# Altium project pioneer_2-bluepill_eletronic_wrapper.PrjPcb
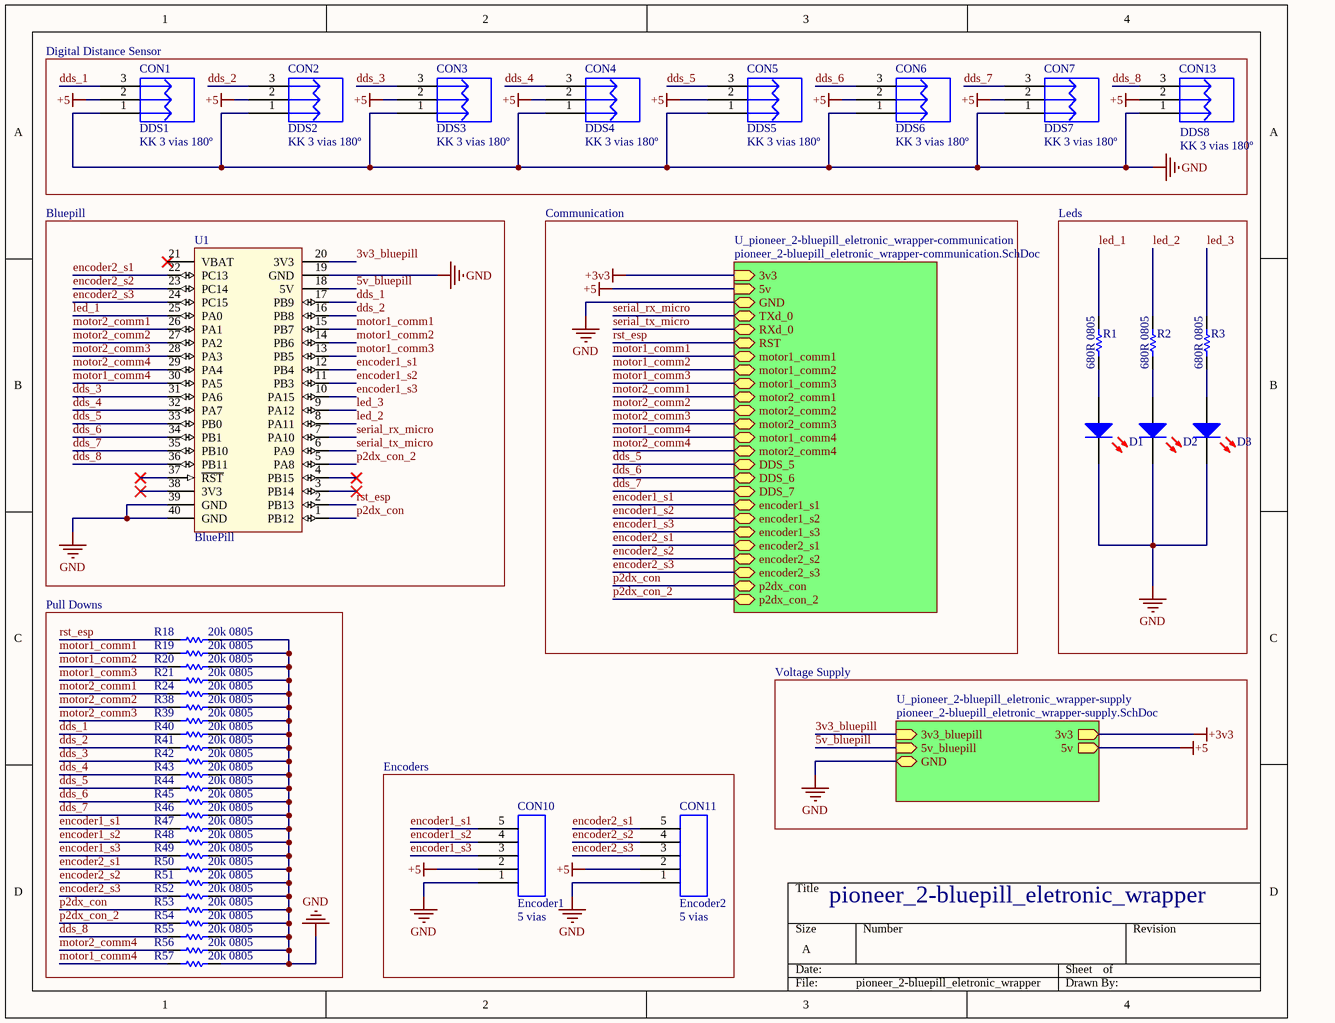
[diagram p0: pioneer_2-bluepill_eletronic_wrapper.SchDoc]
3 sheets, 99 parts. Net scope: hierarchical (ports join the sheet entries above them; power ports are global).
Board file: pioneer_2-bluepill_eletronic_wrapper.PcbDoc
Sheets:
  pioneer_2-bluepill_eletronic_wrapper.SchDoc
    U_pioneer_2-bluepill_eletronic_wrapper-supply = pioneer_2-bluepill_eletronic_wrapper-supply.SchDoc
    U_pioneer_2-bluepill_eletronic_wrapper-communication = pioneer_2-bluepill_eletronic_wrapper-communication.SchDoc

## Sheet pioneer_2-bluepill_eletronic_wrapper.SchDoc
size A; SheetNumber: 1; SheetTotal: 3

### Parts
CON1  DDS1  Valor: KK 3 vias 180º  [KK_3vias_180º]
CON2  DDS2  Valor: KK 3 vias 180º  [KK_3vias_180º]
CON3  DDS3  Valor: KK 3 vias 180º  [KK_3vias_180º]
CON4  DDS4  Valor: KK 3 vias 180º  [KK_3vias_180º]
CON5  DDS5  Valor: KK 3 vias 180º  [KK_3vias_180º]
CON6  DDS6  Valor: KK 3 vias 180º  [KK_3vias_180º]
CON7  DDS7  Valor: KK 3 vias 180º  [KK_3vias_180º]
CON10  Encoder1  Valor: 5 vias  [5vias]
CON11  Encoder2  Valor: 5 vias  [5vias]
CON13  DDS8  Valor: KK 3 vias 180º  [KK_3vias_180º]
D1  LED 3MM RED  [LED RED]  (value not drawn)
D2  LED 3MM RED  [LED RED]  (value not drawn)
D3  LED 3MM RED  [LED RED]  (value not drawn)
R1  680R 0805  [RESISTOR 0805]
R2  680R 0805  [RESISTOR 0805]
R3  680R 0805  [RESISTOR 0805]
R18  20k 0805  [RESISTOR 0805]
R19  20k 0805  [RESISTOR 0805]
R20  20k 0805  [RESISTOR 0805]
R21  20k 0805  [RESISTOR 0805]
R24  20k 0805  [RESISTOR 0805]
R38  20k 0805  [RESISTOR 0805]
R39  20k 0805  [RESISTOR 0805]
R40  20k 0805  [RESISTOR 0805]
R41  20k 0805  [RESISTOR 0805]
R42  20k 0805  [RESISTOR 0805]
R43  20k 0805  [RESISTOR 0805]
R44  20k 0805  [RESISTOR 0805]
R45  20k 0805  [RESISTOR 0805]
R46  20k 0805  [RESISTOR 0805]
R47  20k 0805  [RESISTOR 0805]
R48  20k 0805  [RESISTOR 0805]
R49  20k 0805  [RESISTOR 0805]
R50  20k 0805  [RESISTOR 0805]
R51  20k 0805  [RESISTOR 0805]
R52  20k 0805  [RESISTOR 0805]
R53  20k 0805  [RESISTOR 0805]
R54  20k 0805  [RESISTOR 0805]
R55  20k 0805  [RESISTOR 0805]
R56  20k 0805  [RESISTOR 0805]
R57  20k 0805  [RESISTOR 0805]
U1  BluePill  [BluePill]

### Blocks framed on the sheet
Digital Distance Sensor: CON1-CON7 CON13
Bluepill: U1
Leds: D1-D3 R1-R3
Pull Downs: R18-R21 R24 R38-R57
Encoders: CON10 CON11

### Sub-sheets
U_pioneer_2-bluepill_eletronic_wrapper-communication = pioneer_2-bluepill_eletronic_wrapper-communication.SchDoc: 3v3 (in), 5v (in), GND (bidir), TXd_0 (bidir), RXd_0 (bidir), RST (bidir), motor1_comm1 (bidir), motor1_comm2 (bidir), motor1_comm3 (bidir), motor2_comm1 (bidir), motor2_comm2 (bidir), motor2_comm3 (bidir), motor1_comm4 (bidir), motor2_comm4 (bidir), DDS_5 (bidir), DDS_6 (bidir), DDS_7 (bidir), encoder1_s1 (bidir), encoder1_s2 (bidir), encoder1_s3 (bidir), encoder2_s1 (bidir), encoder2_s2 (bidir), encoder2_s3 (bidir), p2dx_con (bidir), p2dx_con_2 (bidir)
U_pioneer_2-bluepill_eletronic_wrapper-supply = pioneer_2-bluepill_eletronic_wrapper-supply.SchDoc: 3v3_bluepill (in), 5v_bluepill (in), 3v3 (out), 5v (out), GND (bidir)

### Nets
+3v3: sheet U_pioneer_2-bluepill_eletronic_wrapper-supply/3v3, sheet U_pioneer_2-bluepill_eletronic_wrapper-communication/3v3  [project net 3v3]
+5: CON1.2 CON2.2 CON3.2 CON4.2 CON5.2 CON6.2 CON7.2 CON10.2 CON11.2 CON13.2 ; sheet U_pioneer_2-bluepill_eletronic_wrapper-supply/5v, sheet U_pioneer_2-bluepill_eletronic_wrapper-communication/5v  [project net 5v]
GND: CON1.1 CON2.1 CON3.1 CON4.1 CON5.1 CON6.1 CON7.1 CON10.1 CON11.1 CON13.1 D1.2(K) D2.2(K) D3.2(K) R18.2 R19.2 R20.2 R21.2 R24.2 R38.2 R39.2 R40.2 R41.2 R42.2 R43.2 R44.2 R45.2 R46.2 R47.2 R48.2 R49.2 R50.2 R51.2 R52.2 R53.2 R54.2 R55.2 R56.2 R57.2 U1.19(GND) U1.39(GND) U1.40(GND) ; sheet U_pioneer_2-bluepill_eletronic_wrapper-supply/GND, sheet U_pioneer_2-bluepill_eletronic_wrapper-communication/GND
3v3_bluepill: U1.20(3V3) ; sheet U_pioneer_2-bluepill_eletronic_wrapper-supply/3v3_bluepill
5v_bluepill: U1.18(5V) ; sheet U_pioneer_2-bluepill_eletronic_wrapper-supply/5v_bluepill
dds_1: CON1.3 R40.1 U1.17(PB9)
dds_2: CON2.3 R41.1 U1.16(PB8)
dds_3: CON3.3 R42.1 U1.31(PA6)
dds_4: CON4.3 R43.1 U1.32(PA7)
dds_5: CON5.3 R44.1 U1.33(PB0) ; sheet U_pioneer_2-bluepill_eletronic_wrapper-communication/DDS_5
dds_6: CON6.3 R45.1 U1.34(PB1) ; sheet U_pioneer_2-bluepill_eletronic_wrapper-communication/DDS_6
dds_7: CON7.3 R46.1 U1.35(PB10) ; sheet U_pioneer_2-bluepill_eletronic_wrapper-communication/DDS_7
dds_8: CON13.3 R55.1 U1.36(PB11)
encoder1_s1: CON10.5 R47.1 U1.12(PB4) ; sheet U_pioneer_2-bluepill_eletronic_wrapper-communication/encoder1_s1
encoder1_s2: CON10.4 R48.1 U1.11(PB3) ; sheet U_pioneer_2-bluepill_eletronic_wrapper-communication/encoder1_s2
encoder1_s3: CON10.3 R49.1 U1.10(PA15) ; sheet U_pioneer_2-bluepill_eletronic_wrapper-communication/encoder1_s3
encoder2_s1: CON11.5 R50.1 U1.22(PC13) ; sheet U_pioneer_2-bluepill_eletronic_wrapper-communication/encoder2_s1
encoder2_s2: CON11.4 R51.1 U1.23(PC14) ; sheet U_pioneer_2-bluepill_eletronic_wrapper-communication/encoder2_s2
encoder2_s3: CON11.3 R52.1 U1.24(PC15) ; sheet U_pioneer_2-bluepill_eletronic_wrapper-communication/encoder2_s3
led_1: R1.2 U1.25(PA0)
led_2: R2.2 U1.8(PA11)
led_3: R3.2 U1.9(PA12)
motor1_comm1: R19.1 U1.15(PB7) ; sheet U_pioneer_2-bluepill_eletronic_wrapper-communication/motor1_comm1
motor1_comm2: R20.1 U1.14(PB6) ; sheet U_pioneer_2-bluepill_eletronic_wrapper-communication/motor1_comm2
motor1_comm3: R21.1 U1.13(PB5) ; sheet U_pioneer_2-bluepill_eletronic_wrapper-communication/motor1_comm3
motor1_comm4: R57.1 U1.30(PA5) ; sheet U_pioneer_2-bluepill_eletronic_wrapper-communication/motor1_comm4
motor2_comm1: R24.1 U1.26(PA1) ; sheet U_pioneer_2-bluepill_eletronic_wrapper-communication/motor2_comm1
motor2_comm2: R38.1 U1.27(PA2) ; sheet U_pioneer_2-bluepill_eletronic_wrapper-communication/motor2_comm2
motor2_comm3: R39.1 U1.28(PA3) ; sheet U_pioneer_2-bluepill_eletronic_wrapper-communication/motor2_comm3
motor2_comm4: R56.1 U1.29(PA4) ; sheet U_pioneer_2-bluepill_eletronic_wrapper-communication/motor2_comm4
p2dx_con: R53.1 U1.1(PB12) ; sheet U_pioneer_2-bluepill_eletronic_wrapper-communication/p2dx_con
p2dx_con_2: R54.1 U1.5(PA8) ; sheet U_pioneer_2-bluepill_eletronic_wrapper-communication/p2dx_con_2
rst_esp: R18.1 U1.2(PB13) ; sheet U_pioneer_2-bluepill_eletronic_wrapper-communication/RST
serial_rx_micro: U1.7(PA10) ; sheet U_pioneer_2-bluepill_eletronic_wrapper-communication/TXd_0
serial_tx_micro: U1.6(PA9) ; sheet U_pioneer_2-bluepill_eletronic_wrapper-communication/RXd_0  [project net rxd0_bluepill]
NetD1_1: D1.1(A) R1.1
NetD2_1: D2.1(A) R2.1
NetD3_1: D3.1(A) R3.1

Not connected (* = marked no-connect by the designer): U1 3(PB14)* 4(PB15)* 21(VBAT)* 37(~{RST})* 38(3V3)*

### Notes on the sheet
- Communication
- Voltage Supply
- pioneer_2-bluepill_eletronic_wrapper

### Library data of the parts
CON1-CON7 CON13 = KK_2.54_3vias: Conector KK 2.54mm 3 vias; Descrição: Conector KK 3 vias com passo 2.54mm; Encapsulamento: PTH - 180º; Modelo: 3 vias - 180º; Marca: *; Observação: *
CON10 CON11 = 2.54_5vias: holes 2.54mm 5 vias; Descrição: Conector KK 3 vias com passo 2.54mm; Encapsulamento: PTH - 180º; Modelo: 3 vias - 180º; Marca: *; Observação: *
D1-D3 = LED 3MM RED: Manufacturer: Paralight; Manufacturer Part Number: IMP585; Wavelength Typ: 625; Forward Voltage: 2; Forward Current If: 20; Luminous Intensity: 3; LED Mounting: Through Hole; Lens Shape: Round; Viewing Angle: 60°; SVHC: No SVHC (15-Jun-2015); External Diameter: 2.9; External Length / Height: 4.6; Forward Voltage VF Max: 2.5; LED / Lamp Size: 3mm / T-1; LED Type: Standard; Lead Cross-section Depth: 0.5; Luminous Intensity @ If Min: 0.7; PIV Max: 5; Peak Forward Current: 7; Voltage Vf Typ: 2.2V<!--FANDB--><div class="features-and-benefits-container"><div class="features-and-benefits-description"><span class="features-benefits-value">The L-934LID from Kingbright is a through hole round shape high efficiency red colour LED. The device is made of gallium arsenide phosphide on gallium phosphide orange light emitting diode. This LED is widely used because of low power consumption, long life and solid state reliability.</span></div><div class="features-and-benefits-list"><ul class="features-and-benefits-list-list"><li class="features-and-benefits-list-item">Standard bulb size of T-1 (3mm)</li><li class="features-and-benefits-list-item">Reliable and rugged</li><li class="features-and-benefits-list-item">Viewing angle is 60°</li><li class="features-and-benefits-list-item">Luminous intensity of 3mcd at 2mA</li><li class="features-and-benefits-list-item">Forward voltage is 2.0V</li><li class="features-and-benefits-list-item">Forward current (If) is 20mA</li><li class="features-and-benefits-list-item">Dominant wavelength is 625nm at IF=20mA</li><li class="features-and-benefits-list-item">Peak wavelength is 627nm at IF=20; Supplier 1: Mult Comercial; RoHS: YES; Stock 1: 35260; Pricing 1: 1=0.15 (BRL); LED Colour: Red; Bulb Size: 3mm; Packaging: Each; MSL: -; Current If Luminous Intensity: 2; Dominant Wavelength: 625; Forward Current If Max: 20; Lead Cross-section Width: 0.5; Lead Spacing: 2.54; Luminous Intensity Typ: 3; Mounting Type: PCB Through Hole; No. of Pins: 2; Operating Temperature Max: 85; Operating Temperature Min: -40; Operating Temperature Range: -40°C to +85; Peak Wavelength: 625; ComponentLink1URL: http://loja.multcomercial.com.br/led-3mm-vermelho-difuso-l-314hd-paralight.html; ComponentLink1Description: http://loja.multcomercial.com.br/led-3mm-vermelho-difuso-l-314hd-paralight.html; Supplier Part Number 1: Led 3mm Vermelho Difuso L-314HD - Paralight
R1-R3 R18-R21 R24 R38-R57 = RES 0805 5%: 0805; Manufacturer: PANASONIC ELECTRONIC COMPONENTS; Manufacturer Part Number: ERJ-3GEY0R00V; Product Range: AEC-Q200 ERJ3; Resistance: 0; Power Rating: 100; Voltage Rating: 75; Resistor Case Style: 0603 [1608 Metric]; Resistance (Ohms): 0.0; Tolerance: Jumper; Power (Watts): 0.1W, 1/10W; Brand: Panasonic; Qualification: AEC-Q200; RoHS: YES; Resistance Tolerance: -; Packaging: Cut Tape; MSL: -; ComponentLink1URL: http://www.farnell.com/cad/1697908.zip; ComponentLink1Description: http://www.farnell.com/cad/1697908.zip; ComponentLink2URL: http://www.farnell.com/datasheets/1678796.pdf; ComponentLink2Description: http://www.farnell.com/datasheets/1678796.pdf; Category: Resistors; Composition: Thick Film; Features: Automotive AEC-Q200; Temperature Coefficient: -; Operating Temperature: -55°C ~ 155°C; Package / Case: 0603 (1608 Metric); Supplier Device Package: 0603; Size / Dimension: 0.063" L x 0.031" W (1.60mm x 0.80mm); Height: 0.022" (0.55mm); Number of Terminations: 2; ComponentLink3URL: http://industrial.panasonic.com/www-cgi/jvcr13pz.cgi?E+PZ+3+AOA0001+ERJ3GEY0R00V+7+WW; ComponentLink3Description: http://industrial.panasonic.com/www-cgi/jvcr13pz.cgi?E+PZ+3+AOA0001+ERJ3GEY0R00V+7+WW; Supplier 1: Mouser; Stock 1: 1987085; Pricing 1: 1=0.160, 10=0.019, 100=0.013, 500=0.010, 1000=0.005, 5000=0.003 (AUD); Length: 1.6 mm; Operating Temperature Range: - 55 C to + 155 C; Product: Thick Film Resistors Zero-Ohm; Series: ERJ; Termination Style: SMD/SMT; Type: Thick Film Resistors SMD; Width: 0.8 mm; Case Code - in: 0603; Case Code - mm: 1608; RoHS - Mouser: E; Minimum Order Quantity: 1; Reeling: True; ComponentLink4URL: http://www.mouser.com/ds/2/315/AOA0000C84-947596.pdf; ComponentLink4Description: http://www.mouser.com/ds/2/315/AOA0000C84-947596.pdf; Supplier Part Number 1: 667-ERJ-3GEY0R00V
U1 = CMP-010-000000-1: BluePill - STMDuino (STM32F103); Source: uControlador.SchLib; Design Item ID: BluePill; Component Type: Interface

## Sheet pioneer_2-bluepill_eletronic_wrapper-supply.SchDoc
size A; SheetNumber: 2; SheetTotal: 3
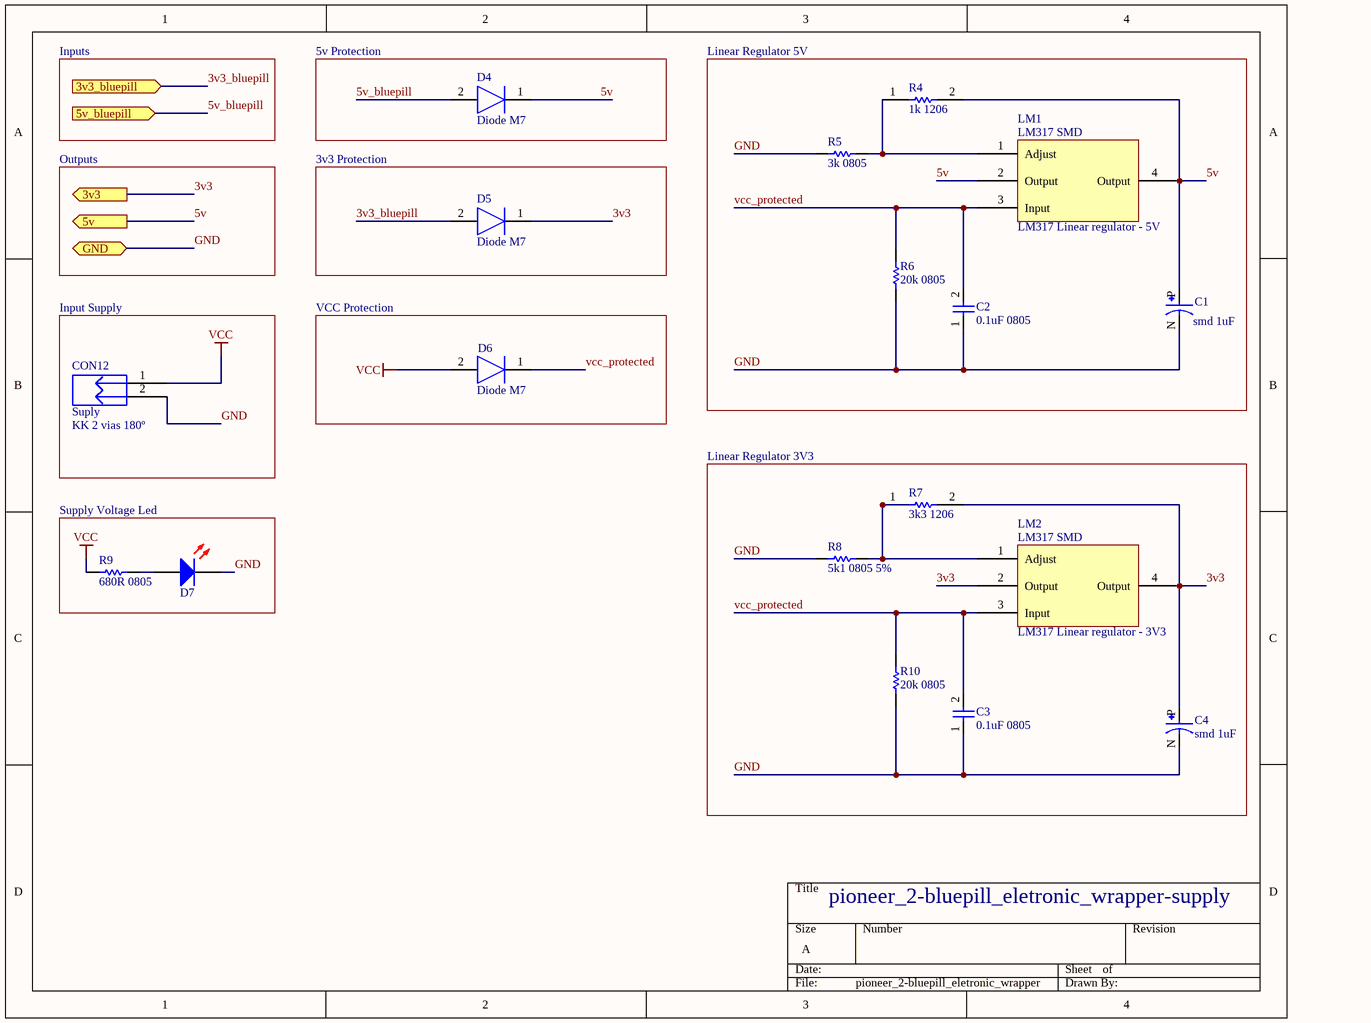
[diagram p1: pioneer_2-bluepill_eletronic_wrapper-supply.SchDoc]

### Parts
C1  smd 1uF  [CAP_EEE1HA2R2SR]
C2  0.1uF 0805  [CAPACITOR 0805]
C3  0.1uF 0805  [CAPACITOR 0805]
C4  smd 1uF  [CAP_EEE1HA2R2SR]
CON12  Suply  Valor: KK 2 vias 180º  [KK_2VIAS_180º]
D4  Diode M7  [DIOM505270X240]
D5  Diode M7  [DIOM505270X240]
D6  Diode M7  [DIOM505270X240]
D7  LED 3MM RED  [LED RED]  (value not drawn)
LM1  LM317 Linear regulator - 5V  [SOT-223-2]
LM2  LM317 Linear regulator - 3V3  [SOT-223-2]
R4  1k 1206  [RESC3216X60N]
R5  3k 0805  [RESISTOR 0805]
R6  20k 0805  [RESISTOR 0805]
R7  3k3 1206  [RESC3216X60N]
R8  5k1 0805 5%  [RESISTOR 0805]
R9  680R 0805  [RESISTOR 0805]
R10  20k 0805  [RESISTOR 0805]

### Blocks framed on the sheet
5v Protection: D4
Linear Regulator 5V: C1 C2 LM1 R4-R6
3v3 Protection: D5
Input Supply: CON12
VCC Protection: D6
Linear Regulator 3V3: C3 C4 LM2 R7 R8 R10
Supply Voltage Led: D7 R9

### Ports
3v3 (out, see pioneer_2-bluepill_eletronic_wrapper[4C], pioneer_2-bluepill_eletronic_wrapper-communication[1A]), 3v3_bluepill (in, see pioneer_2-bluepill_eletronic_wrapper[3C]), 5v (out, see pioneer_2-bluepill_eletronic_wrapper[4C], pioneer_2-bluepill_eletronic_wrapper-communication[1A]), 5v_bluepill (in, see pioneer_2-bluepill_eletronic_wrapper[3C]), GND (bidir, see pioneer_2-bluepill_eletronic_wrapper[3C], pioneer_2-bluepill_eletronic_wrapper-communication[1A])

### Nets
3v3: C4.P D5.1(K) LM2.2(Output) LM2.4(Output) R7.2 ; port 3v3
5v: C1.P D4.1(K) LM1.2(Output) LM1.4(Output) R4.2 ; port 5v
GND: C1.N C2.1 C3.1 C4.N CON12.2 D7.2(K) R5.2 R6.2 R8.1 R10.2 ; port GND
VCC: CON12.1 D6.2(A) R9.2
3v3_bluepill: D5.2(A) ; port 3v3_bluepill
5v_bluepill: D4.2(A) ; port 5v_bluepill
vcc_protected: C2.2 C3.2 D6.1(K) LM1.3(Input) LM2.3(Input) R6.1 R10.1
NetD7_1: D7.1(A) R9.1
NetLM1_1: LM1.1(Adjust) R4.1 R5.1
NetLM2_1: LM2.1(Adjust) R7.1 R8.2

### Notes on the sheet
- Inputs
- Outputs
- pioneer_2-bluepill_eletronic_wrapper-supply
- (in symbol lm317 smd) LM317 SMD

### Library data of the parts
C1 C4 = Cap. Elet. smd 1uF 50V: Aluminum Organic Polymer Capacitors smd 50volts 1uF; Manufacturer_Name: Panasonic; Manufacturer_Part_Number: 16SEPC470M; Datasheet Link: http://industrial.panasonic.com/www-cgi/jvcr13pz.cgi?E+CI+4+AAB8010+16SEPC470M+8+WW; Height: 13mm; Mouser Part Number: 667-16SEPC470M; Mouser Price/Stock: https://www.mouser.co.uk/ProductDetail/Panasonic/16SEPC470M?qs=OE1iw1LrrPEdZuWyF2l%252B5w%3D%3D; Arrow Part Number: 16SEPC470M; Arrow Price/Stock: https://www.arrow.com/en/products/16sepc470m/panasonic
C2 C3 = CAP 0805: capacitor 0805; Manufacturer: PANASONIC ELECTRONIC COMPONENTS; Manufacturer Part Number: ERJ-3GEY0R00V; Product Range: AEC-Q200 ERJ3; Resistance: 0; Power Rating: 100; Voltage Rating: 75; Resistor Case Style: 0603 [1608 Metric]; Resistance (Ohms): 0.0; Tolerance: Jumper; Power (Watts): 0.1W, 1/10W; Type: Thick Film Resistors SMD; Brand: Panasonic; Qualification: AEC-Q200; RoHS: YES; Resistance Tolerance: -; Packaging: Cut Tape; MSL: -; ComponentLink1URL: http://www.farnell.com/cad/1697908.zip; ComponentLink1Description: http://www.farnell.com/cad/1697908.zip; ComponentLink2URL: http://www.farnell.com/datasheets/1678796.pdf; ComponentLink2Description: http://www.farnell.com/datasheets/1678796.pdf; Category: Resistors; Composition: Thick Film; Features: Automotive AEC-Q200; Temperature Coefficient: -; Operating Temperature: -55°C ~ 155°C; Package / Case: 0603 (1608 Metric); Supplier Device Package: 0603; Size / Dimension: 0.063" L x 0.031" W (1.60mm x 0.80mm); Height: 0.022" (0.55mm); Number of Terminations: 2; ComponentLink3URL: http://industrial.panasonic.com/www-cgi/jvcr13pz.cgi?E+PZ+3+AOA0001+ERJ3GEY0R00V+7+WW; ComponentLink3Description: http://industrial.panasonic.com/www-cgi/jvcr13pz.cgi?E+PZ+3+AOA0001+ERJ3GEY0R00V+7+WW; Supplier 1: Mouser; Stock 1: 1987085; Pricing 1: 1=0.160, 10=0.019, 100=0.013, 500=0.010, 1000=0.005, 5000=0.003 (AUD); Length: 1.6 mm; Operating Temperature Range: - 55 C to + 155 C; Product: Thick Film Resistors Zero-Ohm; Series: ERJ; Termination Style: SMD/SMT; Width: 0.8 mm; Case Code - in: 0603; Case Code - mm: 1608; RoHS - Mouser: E; Minimum Order Quantity: 1; Reeling: True; ComponentLink4URL: http://www.mouser.com/ds/2/315/AOA0000C84-947596.pdf; ComponentLink4Description: http://www.mouser.com/ds/2/315/AOA0000C84-947596.pdf; Supplier Part Number 1: 667-ERJ-3GEY0R00V
CON12 = KK_2.54_2vias: Conector KK 2.54mm 2 vias; Descrição: Conector KK 3 vias com passo 2.54mm; Encapsulamento: PTH - 180º; Modelo: 2 vias - 180º; Marca: *; Observação: *
D4-D6 = Diode M7: Diode, SMA, 1000V, 1A, 150°C; MF: Diotec Semiconductor; SnapEDA_Link: https://www.snapeda.com/parts/M7/Diotec/view-part/?ref=snap; Package: DO-214AC Diotec; Value: *; MP: M7; Check_prices: https://www.snapeda.com/parts/M7/Diotec/view-part/?ref=eda
D7 = LED 3MM RED: as D1 on sheet pioneer_2-bluepill_eletronic_wrapper; Supplier 1: Mult Comercial; RoHS: YES; Stock 1: 35260; Pricing 1: 1=0.15 (BRL); LED Colour: Red; Bulb Size: 3mm; Packaging: Each; MSL: -; Current If Luminous Intensity: 2; Dominant Wavelength: 625; Forward Current If Max: 20; Lead Cross-section Width: 0.5; Lead Spacing: 2.54; Luminous Intensity Typ: 3; Mounting Type: PCB Through Hole; No. of Pins: 2; Operating Temperature Max: 85; Operating Temperature Min: -40; Operating Temperature Range: -40°C to +85; Peak Wavelength: 625; ComponentLink1URL: http://loja.multcomercial.com.br/led-3mm-vermelho-difuso-l-314hd-paralight.html; ComponentLink1Description: http://loja.multcomercial.com.br/led-3mm-vermelho-difuso-l-314hd-paralight.html; Supplier Part Number 1: Led 3mm Vermelho Difuso L-314HD - Paralight
LM1 LM2 = lm317 smd: SOT223
R4 R7 = RES 1206: RES 1206 5%; Manufacturer_Name: Vishay; Manufacturer_Part_Number: CRCW12064K70FKEA; Datasheet Link: http://docs-emea.rs-online.com/webdocs/13ec/0900766b813ecc08.pdf; Height: 0.6mm; Mouser Part Number: 71-CRCW1206-4.7K-E3; Mouser Price/Stock: https://www.mouser.co.uk/ProductDetail/Vishay-Dale/CRCW12064K70FKEA?qs=1vm4qhDHCvlKJmatsKzyFQ%3D%3D; Arrow Part Number: CRCW12064K70FKEA; Arrow Price/Stock: https://www.arrow.com/en/products/crcw12064k70fkea/vishay
R5 R6 R8-R10 = RES 0805 5%: as R1 on sheet pioneer_2-bluepill_eletronic_wrapper; RoHS: YES; Resistance Tolerance: -; Packaging: Cut Tape; MSL: -; ComponentLink1URL: http://www.farnell.com/cad/1697908.zip; ComponentLink1Description: http://www.farnell.com/cad/1697908.zip; ComponentLink2URL: http://www.farnell.com/datasheets/1678796.pdf; ComponentLink2Description: http://www.farnell.com/datasheets/1678796.pdf; Category: Resistors; Composition: Thick Film; Features: Automotive AEC-Q200; Temperature Coefficient: -; Operating Temperature: -55°C ~ 155°C; Package / Case: 0603 (1608 Metric); Supplier Device Package: 0603; Size / Dimension: 0.063" L x 0.031" W (1.60mm x 0.80mm); Height: 0.022" (0.55mm); Number of Terminations: 2; ComponentLink3URL: http://industrial.panasonic.com/www-cgi/jvcr13pz.cgi?E+PZ+3+AOA0001+ERJ3GEY0R00V+7+WW; ComponentLink3Description: http://industrial.panasonic.com/www-cgi/jvcr13pz.cgi?E+PZ+3+AOA0001+ERJ3GEY0R00V+7+WW; Supplier 1: Mouser; Stock 1: 1987085; Pricing 1: 1=0.160, 10=0.019, 100=0.013, 500=0.010, 1000=0.005, 5000=0.003 (AUD); Length: 1.6 mm; Operating Temperature Range: - 55 C to + 155 C; Product: Thick Film Resistors Zero-Ohm; Series: ERJ; Termination Style: SMD/SMT; Type: Thick Film Resistors SMD; Width: 0.8 mm; Case Code - in: 0603; Case Code - mm: 1608; RoHS - Mouser: E; Minimum Order Quantity: 1; Reeling: True; ComponentLink4URL: http://www.mouser.com/ds/2/315/AOA0000C84-947596.pdf; ComponentLink4Description: http://www.mouser.com/ds/2/315/AOA0000C84-947596.pdf; Supplier Part Number 1: 667-ERJ-3GEY0R00V

## Sheet pioneer_2-bluepill_eletronic_wrapper-communication.SchDoc
size A; SheetNumber: 3; SheetTotal: 3
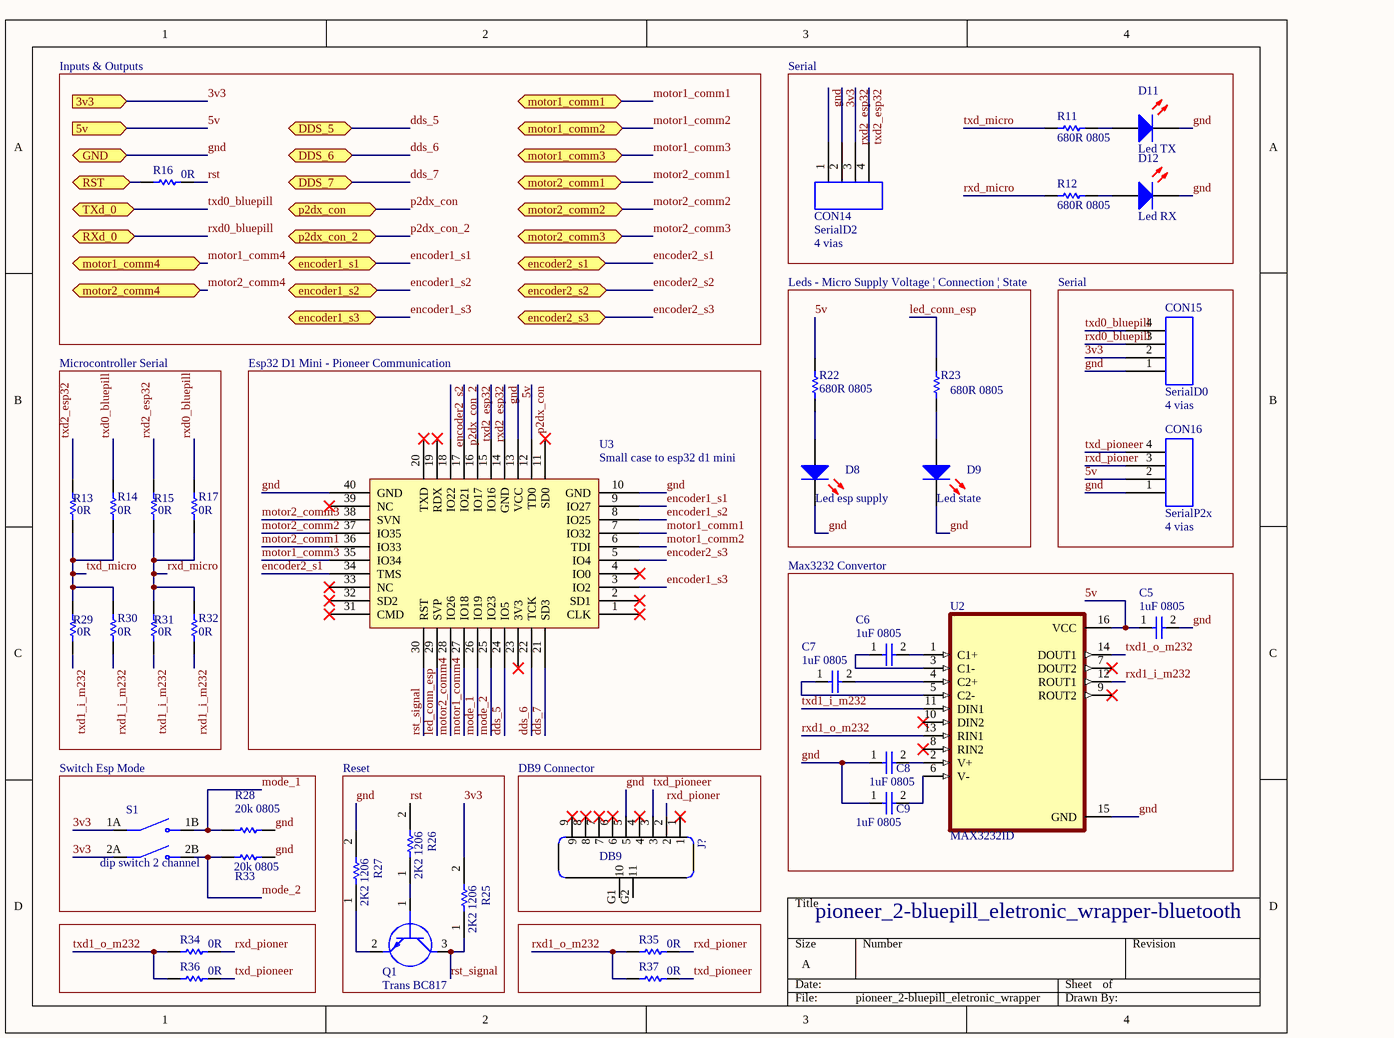
[diagram p2: pioneer_2-bluepill_eletronic_wrapper-communication.SchDoc]

### Parts
C5  1uF 0805  [CAPACITOR 0805]
C6  1uF 0805  [CAPACITOR 0805]
C7  1uF 0805  [CAPACITOR 0805]
C8  1uF 0805  [CAPACITOR 0805]
C9  1uF 0805  [CAPACITOR 0805]
CON14  SerialD2  Valor: 4 vias  [4vias]
CON15  SerialD0  Valor: 4 vias  [4vias]
CON16  SerialP2x  Valor: 4 vias  [4vias]
D8  Led esp supply  [LED RED]
D9  Led state  [LED RED]
D11  Led TX  [LED RED]
D12  Led RX  [LED RED]
J?  DB9  [*DB9_DB9(Primary)]
Q1  Trans BC817  [SOT96P240X110-3N]
R11  680R 0805  [RESISTOR 0805]
R12  680R 0805  [RESISTOR 0805]
R13  0R  [RESISTOR 0603]
R14  0R  [RESISTOR 0603]
R15  0R  [RESISTOR 0603]
R16  0R  [RESISTOR 0603]
R17  0R  [RESISTOR 0603]
R22  680R 0805  [RESISTOR 0805]
R23  680R 0805  [RESISTOR 0805]
R25  2K2 1206  [RESC3216X60N]
R26  2K2 1206  [RESC3216X60N]
R27  2K2 1206  [RESC3216X60N]
R28  20k 0805  [RESISTOR 0805]
R29  0R  [RESISTOR 0603]
R30  0R  [RESISTOR 0603]
R31  0R  [RESISTOR 0603]
R32  0R  [RESISTOR 0603]
R33  20k 0805  [RESISTOR 0805]
R34  0R  [RESISTOR 0603]
R35  0R  [RESISTOR 0603]
R36  0R  [RESISTOR 0603]
R37  0R  [RESISTOR 0603]
S1  dip switch 2 channel  [SW_DS02-254-2L-02BE]
U2  MAX3232ID  [SOIC127P600X175-16N]
U3  Small case to esp32 d1 mini  [ESP32 D1 MINI]

### Blocks framed on the sheet
Inputs & Outputs: R16
Serial: CON14 D11 D12 R11 R12
Leds - Micro Supply Voltage | Connection | State: D8 D9 R22 R23
Serial: CON15 CON16
Microcontroller Serial: R13-R15 R17 R29-R32
Esp32 D1 Mini - Pioneer Communication: U3
Max3232 Convertor: C5-C9 U2
Switch Esp Mode: R28 R33 S1
Reset: Q1 R25-R27
DB9 Connector: J?

### Ports
3v3 (in, see pioneer_2-bluepill_eletronic_wrapper[3B], pioneer_2-bluepill_eletronic_wrapper-supply[1A]), 5v (in, see pioneer_2-bluepill_eletronic_wrapper[3B], pioneer_2-bluepill_eletronic_wrapper-supply[1A]), DDS_5 (bidir, see pioneer_2-bluepill_eletronic_wrapper[3B]), DDS_6 (bidir, see pioneer_2-bluepill_eletronic_wrapper[3B]), DDS_7 (bidir, see pioneer_2-bluepill_eletronic_wrapper[3B]), encoder1_s1 (bidir, see pioneer_2-bluepill_eletronic_wrapper[3B]), encoder1_s2 (bidir, see pioneer_2-bluepill_eletronic_wrapper[3C]), encoder1_s3 (bidir, see pioneer_2-bluepill_eletronic_wrapper[3C]), encoder2_s1 (bidir, see pioneer_2-bluepill_eletronic_wrapper[3C]), encoder2_s2 (bidir, see pioneer_2-bluepill_eletronic_wrapper[3C]), encoder2_s3 (bidir, see pioneer_2-bluepill_eletronic_wrapper[3C]), GND (bidir, see pioneer_2-bluepill_eletronic_wrapper[3B], pioneer_2-bluepill_eletronic_wrapper-supply[1A]), motor1_comm1 (bidir, see pioneer_2-bluepill_eletronic_wrapper[3B]), motor1_comm2 (bidir, see pioneer_2-bluepill_eletronic_wrapper[3B]), motor1_comm3 (bidir, see pioneer_2-bluepill_eletronic_wrapper[3B]), motor1_comm4 (bidir, see pioneer_2-bluepill_eletronic_wrapper[3B]), motor2_comm1 (bidir, see pioneer_2-bluepill_eletronic_wrapper[3B]), motor2_comm2 (bidir, see pioneer_2-bluepill_eletronic_wrapper[3B]), motor2_comm3 (bidir, see pioneer_2-bluepill_eletronic_wrapper[3B]), motor2_comm4 (bidir, see pioneer_2-bluepill_eletronic_wrapper[3B]), p2dx_con (bidir, see pioneer_2-bluepill_eletronic_wrapper[3C]), p2dx_con_2 (bidir, see pioneer_2-bluepill_eletronic_wrapper[3C]), RST (bidir, see pioneer_2-bluepill_eletronic_wrapper[3B]), RXd_0 (bidir, see pioneer_2-bluepill_eletronic_wrapper[3B]), TXd_0 (bidir, see pioneer_2-bluepill_eletronic_wrapper[3B])

### Nets
3v3: CON14.2 CON15.2 R25.2 S1.1A(COM1) S1.2A(COM2) ; port 3v3
5v: C5.1 CON16.2 R22.2 U2.16(VCC) U3.13(VCC) ; port 5v
GND: C5.2 C8.1 C9.1 CON14.1 CON15.1 CON16.1 D8.2(K) D9.2(K) D11.2(K) D12.2(K) J?.5 R27.2 R28.1 R33.2 U2.15(GND) U3.10(GND) U3.14(GND) U3.40(GND) ; port GND
dds_5: U3.24(IO5) ; port DDS_5
dds_6: U3.22(TCK) ; port DDS_6
dds_7: U3.21(SD3) ; port DDS_7
encoder1_s1: U3.9(IO27) ; port encoder1_s1
encoder1_s2: U3.8(IO25) ; port encoder1_s2
encoder1_s3: U3.3(IO2) ; port encoder1_s3
encoder2_s1: U3.34(TMS) ; port encoder2_s1
encoder2_s2: U3.18(IO22) ; port encoder2_s2
encoder2_s3: U3.5(IO4) ; port encoder2_s3
led_conn_esp: R23.2 U3.29(SVP)
mode_1: R28.2 S1.1B(NO1) U3.26(IO19)
mode_2: R33.1 S1.2B(NO2) U3.25(IO23)
motor1_comm1: U3.7(IO32) ; port motor1_comm1
motor1_comm2: U3.6(TDI) ; port motor1_comm2
motor1_comm3: U3.35(IO34) ; port motor1_comm3
motor1_comm4: U3.27(IO18) ; port motor1_comm4
motor2_comm1: U3.36(IO33) ; port motor2_comm1
motor2_comm2: U3.37(IO35) ; port motor2_comm2
motor2_comm3: U3.38(SVN) ; port motor2_comm3
motor2_comm4: U3.28(IO26) ; port motor2_comm4
p2dx_con: U3.12(TD0) ; port p2dx_con
p2dx_con_2: U3.17(IO21) ; port p2dx_con_2
rst: R16.2 R26.2
rst_esp: R16.1 ; port RST
rst_signal: Q1.3(C) R25.1 U3.30(RST)
rxd0_bluepill: CON15.3 R17.2 ; port RXd_0
rxd1_i_m232: R30.1 R32.1 U2.12(ROUT1)
rxd1_o_m232: R35.2 R37.2 U2.13(RIN1)
rxd2_esp32: CON14.3 R15.2 U3.15(IO16)
rxd_micro: R12.2 R15.1 R17.1 R31.2 R32.2
rxd_pioner: CON16.3 J?.2 R34.1 R35.1
txd0_bluepill: CON15.4 R14.2 ; port TXd_0  [project net serial_rx_micro]
txd1_i_m232: R29.1 R31.1 U2.11(DIN1)
txd1_o_m232: R34.2 R36.2 U2.14(DOUT1)
txd2_esp32: CON14.4 R13.2 U3.16(IO17)
txd_micro: R11.2 R13.1 R14.1 R29.2 R30.2
txd_pioneer: CON16.4 J?.3 R36.1 R37.1
NetC6_1: C6.1 U2.3(C1-)
NetC6_2: C6.2 U2.1(C1+)
NetC7_1: C7.1 U2.5(C2-)
NetC7_2: C7.2 U2.4(C2+)
NetC8_2: C8.2 U2.2(V+)
NetC9_2: C9.2 U2.6(V-)
NetD8_1: D8.1(A) R22.1
NetD9_1: D9.1(A) R23.1
NetD11_1: D11.1(A) R11.1
NetD12_1: D12.1(A) R12.1
NetQ1_1: Q1.1(B) R26.1
NetQ1_2: Q1.2(E) R27.1

Not connected (* = marked no-connect by the designer): J? 1* 4* 6* 7* 8* 9* G1(10) G2(11); U2 7(DOUT2)* 8(RIN2)* 9(ROUT2)* 10(DIN2)*; U3 1(CLK)* 2(SD1)* 4(IO0)* 11(SD0)* 19(RDX)* 20(TXD)* 23(3V3)* 31(CMD)* 32(SD2)* 33(NC)* 39(NC)*

### Notes on the sheet
- pioneer_2-bluepill_eletronic_wrapper-bluetooth

### Library data of the parts
C5-C9 = CAP 0805: as C2 on sheet pioneer_2-bluepill_eletronic_wrapper-supply; RoHS: YES; Resistance Tolerance: -; Packaging: Cut Tape; MSL: -; ComponentLink1URL: http://www.farnell.com/cad/1697908.zip; ComponentLink1Description: http://www.farnell.com/cad/1697908.zip; ComponentLink2URL: http://www.farnell.com/datasheets/1678796.pdf; ComponentLink2Description: http://www.farnell.com/datasheets/1678796.pdf; Category: Resistors; Composition: Thick Film; Features: Automotive AEC-Q200; Temperature Coefficient: -; Operating Temperature: -55°C ~ 155°C; Package / Case: 0603 (1608 Metric); Supplier Device Package: 0603; Size / Dimension: 0.063" L x 0.031" W (1.60mm x 0.80mm); Height: 0.022" (0.55mm); Number of Terminations: 2; ComponentLink3URL: http://industrial.panasonic.com/www-cgi/jvcr13pz.cgi?E+PZ+3+AOA0001+ERJ3GEY0R00V+7+WW; ComponentLink3Description: http://industrial.panasonic.com/www-cgi/jvcr13pz.cgi?E+PZ+3+AOA0001+ERJ3GEY0R00V+7+WW; Supplier 1: Mouser; Stock 1: 1987085; Pricing 1: 1=0.160, 10=0.019, 100=0.013, 500=0.010, 1000=0.005, 5000=0.003 (AUD); Length: 1.6 mm; Operating Temperature Range: - 55 C to + 155 C; Product: Thick Film Resistors Zero-Ohm; Series: ERJ; Termination Style: SMD/SMT; Width: 0.8 mm; Case Code - in: 0603; Case Code - mm: 1608; RoHS - Mouser: E; Minimum Order Quantity: 1; Reeling: True; ComponentLink4URL: http://www.mouser.com/ds/2/315/AOA0000C84-947596.pdf; ComponentLink4Description: http://www.mouser.com/ds/2/315/AOA0000C84-947596.pdf; Supplier Part Number 1: 667-ERJ-3GEY0R00V
CON14-CON16 = 2.54_4vias: holes 2.54mm 4 vias; Descrição: Conector KK 3 vias com passo 2.54mm; Encapsulamento: PTH - 180º; Modelo: 3 vias - 180º; Marca: *; Observação: *
D8 D9 D11 D12 = LED 3MM RED: as D1 on sheet pioneer_2-bluepill_eletronic_wrapper; Supplier 1: Mult Comercial; RoHS: YES; Stock 1: 35260; Pricing 1: 1=0.15 (BRL); LED Colour: Red; Bulb Size: 3mm; Packaging: Each; MSL: -; Current If Luminous Intensity: 2; Dominant Wavelength: 625; Forward Current If Max: 20; Lead Cross-section Width: 0.5; Lead Spacing: 2.54; Luminous Intensity Typ: 3; Mounting Type: PCB Through Hole; No. of Pins: 2; Operating Temperature Max: 85; Operating Temperature Min: -40; Operating Temperature Range: -40°C to +85; Peak Wavelength: 625; ComponentLink1URL: http://loja.multcomercial.com.br/led-3mm-vermelho-difuso-l-314hd-paralight.html; ComponentLink1Description: http://loja.multcomercial.com.br/led-3mm-vermelho-difuso-l-314hd-paralight.html; Supplier Part Number 1: Led 3mm Vermelho Difuso L-314HD - Paralight
J? = DB9: Cable Grip 0.38 ~ 0.50 (9.5mm ~ 12.7mm) Aluminum - Silver; MF: Amphenol; MP: DB-9; SnapEDA_Link: https://www.snapeda.com/parts/DB-9/Amphenol/view-part/?ref=snap; Package: None; Check_prices: https://www.snapeda.com/parts/DB-9/Amphenol/view-part/?ref=eda; Value: *
Q1 = Trans BC817: Transistor BJT NPN BC817-25-7-F; Manufacturer_Name: Diodes Inc.; Datasheet Link: https://www.diodes.com/assets/Datasheets/ds11107.pdf; Height: 1.1mm; Manufacturer_Part_Number: BC817-25-7-F; Mouser Part Number: 621-BC817-25-7-F; Mouser Price/Stock: https://www.mouser.co.uk/ProductDetail/Diodes-Incorporated/BC817-25-7-F?qs=rGAXPo9uwV0jK0EyLZnqOw%3D%3D; Arrow Part Number: BC817-25-7-F; Arrow Price/Stock: https://www.arrow.com/en/products/bc817-25-7-f/diodes-incorporated
R11 R12 R22 R23 R28 R33 = RES 0805 5%: as R1 on sheet pioneer_2-bluepill_eletronic_wrapper; RoHS: YES; Resistance Tolerance: -; Packaging: Cut Tape; MSL: -; ComponentLink1URL: http://www.farnell.com/cad/1697908.zip; ComponentLink1Description: http://www.farnell.com/cad/1697908.zip; ComponentLink2URL: http://www.farnell.com/datasheets/1678796.pdf; ComponentLink2Description: http://www.farnell.com/datasheets/1678796.pdf; Category: Resistors; Composition: Thick Film; Features: Automotive AEC-Q200; Temperature Coefficient: -; Operating Temperature: -55°C ~ 155°C; Package / Case: 0603 (1608 Metric); Supplier Device Package: 0603; Size / Dimension: 0.063" L x 0.031" W (1.60mm x 0.80mm); Height: 0.022" (0.55mm); Number of Terminations: 2; ComponentLink3URL: http://industrial.panasonic.com/www-cgi/jvcr13pz.cgi?E+PZ+3+AOA0001+ERJ3GEY0R00V+7+WW; ComponentLink3Description: http://industrial.panasonic.com/www-cgi/jvcr13pz.cgi?E+PZ+3+AOA0001+ERJ3GEY0R00V+7+WW; Supplier 1: Mouser; Stock 1: 1987085; Pricing 1: 1=0.160, 10=0.019, 100=0.013, 500=0.010, 1000=0.005, 5000=0.003 (AUD); Length: 1.6 mm; Operating Temperature Range: - 55 C to + 155 C; Product: Thick Film Resistors Zero-Ohm; Series: ERJ; Termination Style: SMD/SMT; Type: Thick Film Resistors SMD; Width: 0.8 mm; Case Code - in: 0603; Case Code - mm: 1608; RoHS - Mouser: E; Minimum Order Quantity: 1; Reeling: True; ComponentLink4URL: http://www.mouser.com/ds/2/315/AOA0000C84-947596.pdf; ComponentLink4Description: http://www.mouser.com/ds/2/315/AOA0000C84-947596.pdf; Supplier Part Number 1: 667-ERJ-3GEY0R00V
R13-R17 R29-R32 R34-R37 = RES 0603 5%: 0603; Manufacturer: PANASONIC ELECTRONIC COMPONENTS; Manufacturer Part Number: ERJ-3GEY0R00V; Product Range: AEC-Q200 ERJ3; Resistance: 0; Power Rating: 100; Voltage Rating: 75; Resistor Case Style: 0603 [1608 Metric]; Resistance (Ohms): 0.0; Tolerance: Jumper; Power (Watts): 0.1W, 1/10W; Brand: Panasonic; Qualification: AEC-Q200; RoHS: YES; Resistance Tolerance: -; Packaging: Cut Tape; MSL: -; ComponentLink1URL: http://www.farnell.com/cad/1697908.zip; ComponentLink1Description: http://www.farnell.com/cad/1697908.zip; ComponentLink2URL: http://www.farnell.com/datasheets/1678796.pdf; ComponentLink2Description: http://www.farnell.com/datasheets/1678796.pdf; Category: Resistors; Composition: Thick Film; Features: Automotive AEC-Q200; Temperature Coefficient: -; Operating Temperature: -55°C ~ 155°C; Package / Case: 0603 (1608 Metric); Supplier Device Package: 0603; Size / Dimension: 0.063" L x 0.031" W (1.60mm x 0.80mm); Height: 0.022" (0.55mm); Number of Terminations: 2; ComponentLink3URL: http://industrial.panasonic.com/www-cgi/jvcr13pz.cgi?E+PZ+3+AOA0001+ERJ3GEY0R00V+7+WW; ComponentLink3Description: http://industrial.panasonic.com/www-cgi/jvcr13pz.cgi?E+PZ+3+AOA0001+ERJ3GEY0R00V+7+WW; Supplier 1: Mouser; Stock 1: 1987085; Pricing 1: 1=0.160, 10=0.019, 100=0.013, 500=0.010, 1000=0.005, 5000=0.003 (AUD); Length: 1.6 mm; Operating Temperature Range: - 55 C to + 155 C; Product: Thick Film Resistors Zero-Ohm; Series: ERJ; Termination Style: SMD/SMT; Type: Thick Film Resistors SMD; Width: 0.8 mm; Case Code - in: 0603; Case Code - mm: 1608; RoHS - Mouser: E; Minimum Order Quantity: 1; Reeling: True; ComponentLink4URL: http://www.mouser.com/ds/2/315/AOA0000C84-947596.pdf; ComponentLink4Description: http://www.mouser.com/ds/2/315/AOA0000C84-947596.pdf; Supplier Part Number 1: 667-ERJ-3GEY0R00V
R25-R27 = RES 1206: as R4 on sheet pioneer_2-bluepill_eletronic_wrapper-supply; Datasheet Link: http://docs-emea.rs-online.com/webdocs/13ec/0900766b813ecc08.pdf; Height: 0.6mm; Mouser Part Number: 71-CRCW1206-4.7K-E3; Mouser Price/Stock: https://www.mouser.co.uk/ProductDetail/Vishay-Dale/CRCW12064K70FKEA?qs=1vm4qhDHCvlKJmatsKzyFQ%3D%3D; Arrow Part Number: CRCW12064K70FKEA; Arrow Price/Stock: https://www.arrow.com/en/products/crcw12064k70fkea/vishay
S1 = dip switch 2 channel: DS02-254-2L-02BE; Price: None; MP: DS02-254-2L-02BE; Availability: Unavailable; Value: *; Package: None
U2 = MAX3232ID: 3-V to 5.5-V multichannel RS-232 line driver & receiver 16-SOIC -40 to 85; MF: Texas Instruments; Price: None; Value: *; Package: SOIC-16 Texas Instruments; Mouser-Purchase-URL: https://snapeda.com/shop?store=Mouser&id=215166; SnapEDA_Link: https://www.snapeda.com/parts/MAX3232ID/Texas%20Instruments/view-part/215166/?ref=snap; DigiKey-Purchase-URL: https://snapeda.com/shop?store=DigiKey&id=215166; MP: MAX3232ID; Texas_Instruments-Purchase-URL: https://snapeda.com/shop?store=Texas+Instruments&id=215166; Availability: Good
U3 = ESP32 D1 Mini

## Nets that join several sheets
3v3: pioneer_2-bluepill_eletronic_wrapper-supply (5 pins), pioneer_2-bluepill_eletronic_wrapper-communication (5 pins)
5v: pioneer_2-bluepill_eletronic_wrapper (10 pins), pioneer_2-bluepill_eletronic_wrapper-supply (5 pins), pioneer_2-bluepill_eletronic_wrapper-communication (5 pins)
GND: pioneer_2-bluepill_eletronic_wrapper (41 pins), pioneer_2-bluepill_eletronic_wrapper-supply (10 pins), pioneer_2-bluepill_eletronic_wrapper-communication (18 pins)
3v3_bluepill: pioneer_2-bluepill_eletronic_wrapper (U1.20), pioneer_2-bluepill_eletronic_wrapper-supply (D5.2)
5v_bluepill: pioneer_2-bluepill_eletronic_wrapper (U1.18), pioneer_2-bluepill_eletronic_wrapper-supply (D4.2)
dds_5: pioneer_2-bluepill_eletronic_wrapper (CON5.3 R44.1 U1.33), pioneer_2-bluepill_eletronic_wrapper-communication (U3.24)
dds_6: pioneer_2-bluepill_eletronic_wrapper (CON6.3 R45.1 U1.34), pioneer_2-bluepill_eletronic_wrapper-communication (U3.22)
dds_7: pioneer_2-bluepill_eletronic_wrapper (CON7.3 R46.1 U1.35), pioneer_2-bluepill_eletronic_wrapper-communication (U3.21)
encoder1_s1: pioneer_2-bluepill_eletronic_wrapper (CON10.5 R47.1 U1.12), pioneer_2-bluepill_eletronic_wrapper-communication (U3.9)
encoder1_s2: pioneer_2-bluepill_eletronic_wrapper (CON10.4 R48.1 U1.11), pioneer_2-bluepill_eletronic_wrapper-communication (U3.8)
encoder1_s3: pioneer_2-bluepill_eletronic_wrapper (CON10.3 R49.1 U1.10), pioneer_2-bluepill_eletronic_wrapper-communication (U3.3)
encoder2_s1: pioneer_2-bluepill_eletronic_wrapper (CON11.5 R50.1 U1.22), pioneer_2-bluepill_eletronic_wrapper-communication (U3.34)
encoder2_s2: pioneer_2-bluepill_eletronic_wrapper (CON11.4 R51.1 U1.23), pioneer_2-bluepill_eletronic_wrapper-communication (U3.18)
encoder2_s3: pioneer_2-bluepill_eletronic_wrapper (CON11.3 R52.1 U1.24), pioneer_2-bluepill_eletronic_wrapper-communication (U3.5)
motor1_comm1: pioneer_2-bluepill_eletronic_wrapper (R19.1 U1.15), pioneer_2-bluepill_eletronic_wrapper-communication (U3.7)
motor1_comm2: pioneer_2-bluepill_eletronic_wrapper (R20.1 U1.14), pioneer_2-bluepill_eletronic_wrapper-communication (U3.6)
motor1_comm3: pioneer_2-bluepill_eletronic_wrapper (R21.1 U1.13), pioneer_2-bluepill_eletronic_wrapper-communication (U3.35)
motor1_comm4: pioneer_2-bluepill_eletronic_wrapper (R57.1 U1.30), pioneer_2-bluepill_eletronic_wrapper-communication (U3.27)
motor2_comm1: pioneer_2-bluepill_eletronic_wrapper (R24.1 U1.26), pioneer_2-bluepill_eletronic_wrapper-communication (U3.36)
motor2_comm2: pioneer_2-bluepill_eletronic_wrapper (R38.1 U1.27), pioneer_2-bluepill_eletronic_wrapper-communication (U3.37)
motor2_comm3: pioneer_2-bluepill_eletronic_wrapper (R39.1 U1.28), pioneer_2-bluepill_eletronic_wrapper-communication (U3.38)
motor2_comm4: pioneer_2-bluepill_eletronic_wrapper (R56.1 U1.29), pioneer_2-bluepill_eletronic_wrapper-communication (U3.28)
p2dx_con: pioneer_2-bluepill_eletronic_wrapper (R53.1 U1.1), pioneer_2-bluepill_eletronic_wrapper-communication (U3.12)
p2dx_con_2: pioneer_2-bluepill_eletronic_wrapper (R54.1 U1.5), pioneer_2-bluepill_eletronic_wrapper-communication (U3.17)
rst_esp: pioneer_2-bluepill_eletronic_wrapper (R18.1 U1.2), pioneer_2-bluepill_eletronic_wrapper-communication (R16.1)
rxd0_bluepill: pioneer_2-bluepill_eletronic_wrapper (U1.6), pioneer_2-bluepill_eletronic_wrapper-communication (CON15.3 R17.2)
serial_rx_micro: pioneer_2-bluepill_eletronic_wrapper (U1.7), pioneer_2-bluepill_eletronic_wrapper-communication (CON15.4 R14.2)